# Altium schematic sheet PowerAmplifier_Control.SchDoc
size A4
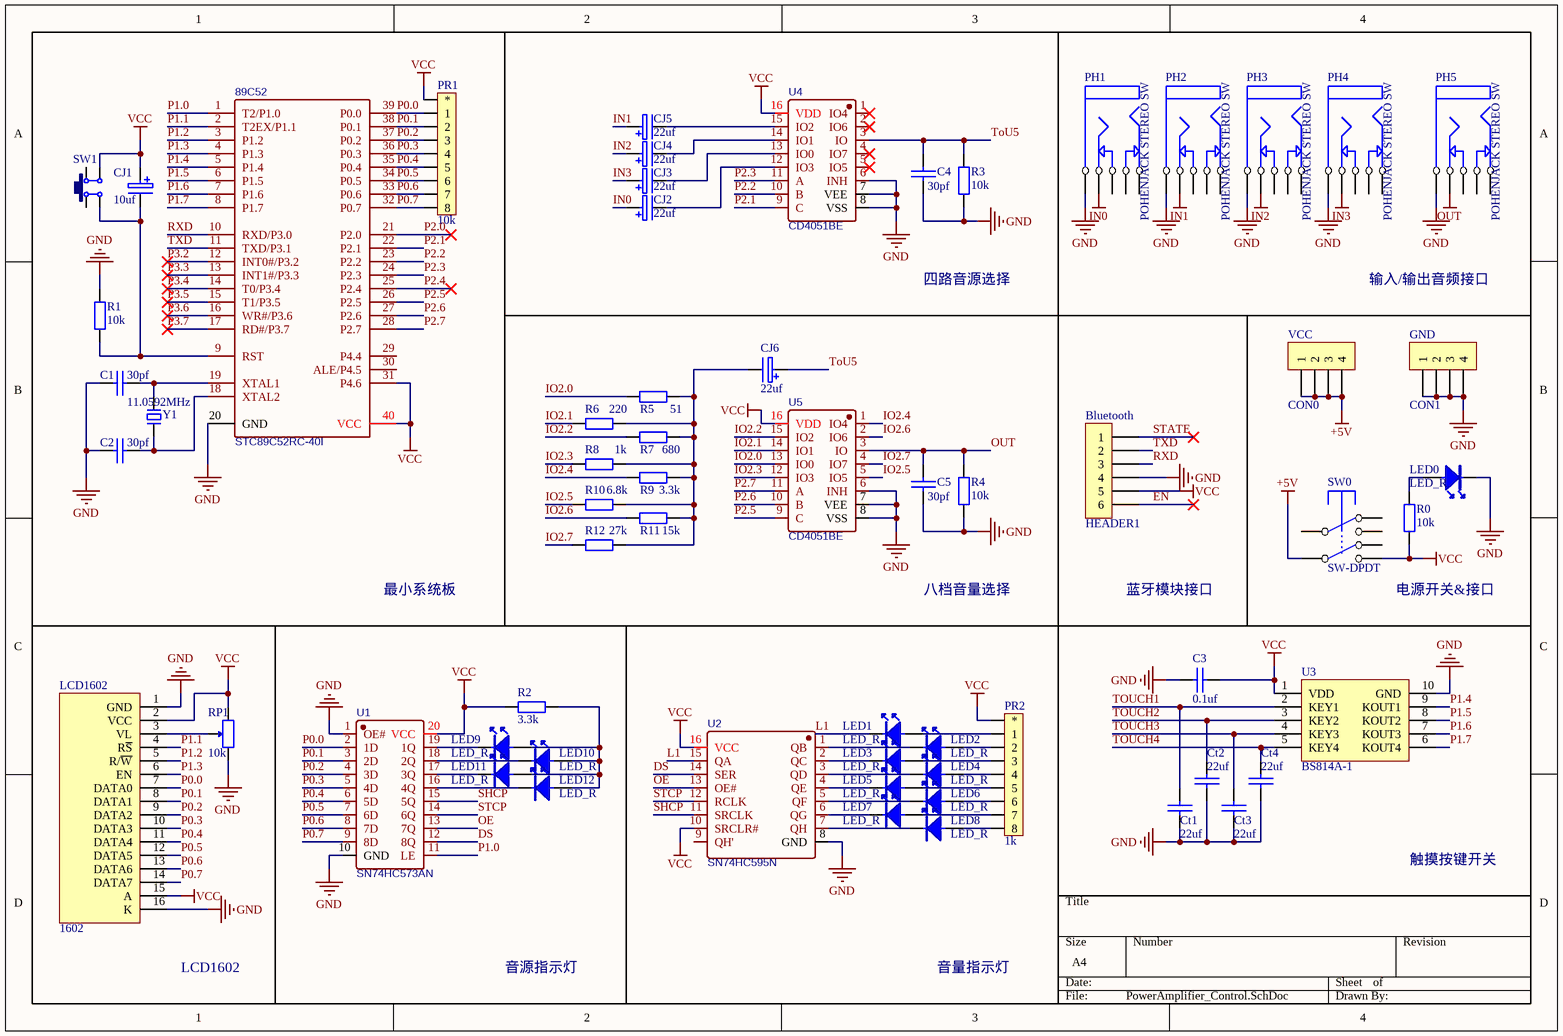
[diagram p0: PowerAmplifier_Control.SchDoc]

## Parts
89C52  STC89C52RC-40I  [DIP-40_LS15.24-L52.58-W13.97-PITCH2.54]
Bluetooth  HEADER1  [sip-6]
C1  30pf  [1206]
C2  30pf  [1206]
C3  0.1uf  [1206]
C4  30pf  [1206]
C5  30pf  [1206]
CJ1  10uf  [CAO1]
CJ2  22uf  [CAO1]
CJ3  22uf  [CAO1]
CJ4  22uf  [CAO1]
CJ5  22uf  [CAO1]
CJ6  22uf  [CAO1]
Ct1  22uf  [1206]
Ct2  22uf  [1206]
Ct3  22uf  [1206]
Ct4  22uf  [1206]
GND  CON1  [sip-4]
LCD1602  1602  [1602]
LED0  LED_R  [LED_1206]
LED1  LED_R  [LED_1206]
LED2  LED_R  [LED_1206]
LED3  LED_R  [LED_1206]
LED4  LED_R  [LED_1206]
LED5  LED_R  [LED_1206]
LED6  LED_R  [LED_1206]
LED7  LED_R  [LED_1206]
LED8  LED_R  [LED_1206]
LED9  LED_R  [LED_1206]
LED10  LED_R  [LED_1206]
LED11  LED_R  [LED_1206]
LED12  LED_R  [LED_1206]
PH1  POHENJACK STEREO SW  [POHENJACK STEREO SW]
PH2  POHENJACK STEREO SW  [POHENJACK STEREO SW]
PH3  POHENJACK STEREO SW  [POHENJACK STEREO SW]
PH4  POHENJACK STEREO SW  [POHENJACK STEREO SW]
PH5  POHENJACK STEREO SW  [POHENJACK STEREO SW]
PR1  10k  [RP1]
PR2  1k  [RP1]
R0  10k  [AXIAL0.4]
R1  10k  [AXIAL0.4]
R2  3.3k  [AXIAL0.4]
R3  10k  [AXIAL0.4]
R4  10k  [AXIAL0.4]
R5  51  [AXIAL0.4]
R6  220  [AXIAL0.4]
R7  680  [AXIAL0.4]
R8  1k  [AXIAL0.4]
R9  3.3k  [AXIAL0.4]
R10  6.8k  [AXIAL0.4]
R11  15k  [AXIAL0.4]
R12  27k  [AXIAL0.4]
RP1  10k  [3296W]
SW0  SW-DPDT  [SWH7*7]
SW1  6x6x5  [TSW DIP-6*6*6]  (value not drawn)
U1  SN74HC573AN  [DIP-20_L26.8-W6.4-P2.54-LS7.6-BL]
U2  SN74HC595N  [DIP-16_L19.8-W6.5-P2.54-LS7.6-BL]
U3  BS814A-1  [MSOP10_N]
U4  CD4051BE  [DIP-16_L20.0-W6.4-P2.54-LS7.6-BL]
U5  CD4051BE  [DIP-16_L20.0-W6.4-P2.54-LS7.6-BL]
VCC  CON0  [sip-4]
Y1  11.0592MHz  [OSC HC-49S]

## Nets
+5V: SW0.5 VCC.1 VCC.2 VCC.3 VCC.4
GND: 89C52.20(GND) Bluetooth.4 C1.2 C2.2 C3.1 C4.2 C5.2 Ct1.2 Ct2.2 Ct3.2 Ct4.2 GND.1 GND.2 GND.3 GND.4 LCD1602.1(GND) LCD1602.16(K) LED0.2 PH1.5(E) PH2.5(E) PH3.5(E) PH4.5(E) PH5.5(E) R1.1 R3.1 R4.1 RP1.1 U1.1(OE#) U1.10(GND) U2.8(GND) U3.10(GND) U4.6(INH) U4.7(VEE) U4.8(VSS) U5.6(INH) U5.7(VEE) U5.8(VSS)
IN0: CJ2.1 PH1.4(D)
IN1: CJ5.1 PH2.4(D)
IN2: CJ4.1 PH3.4(D)
IN3: CJ3.1 PH4.4(D)
OUT: C5.1 PH5.4(D) R4.2 U5.3(IO)
VCC: 89C52.31(P4.6) 89C52.40(VCC) Bluetooth.5 C3.2 CJ1.1 LCD1602.2(VCC) LCD1602.15(A) PR1.1 PR2.1 R0.2 R2.2 RP1.3 SW0.4 SW1.3 U1.20(VCC) U2.10(SRCLR#) U2.16(VCC) U3.1(VDD) U4.16(VDD) U5.16(VDD)
DS: U1.12(8Q) U2.14(SER)
EN: Bluetooth.6
IO2.0: R5.1 U5.13(IO0)
IO2.1: R6.1 U5.14(IO1)
IO2.2: R7.1 U5.15(IO2)
IO2.3: R8.1 U5.12(IO3)
IO2.4: R9.1 U5.1(IO4)
IO2.5: R10.1 U5.5(IO5)
IO2.6: R11.1 U5.2(IO6)
IO2.7: R12.1 U5.4(IO7)
L1: LED1.2 U2.15(QA)
OE: U1.13(7Q) U2.13(OE#)
P0.0: 89C52.39(P0.0) LCD1602.7(DATA0) PR1.2(1) U1.2(1D)
P0.1: 89C52.38(P0.1) LCD1602.8(DATA1) PR1.3(2) U1.3(2D)
P0.2: 89C52.37(P0.2) LCD1602.9(DATA2) PR1.4(3) U1.4(3D)
P0.3: 89C52.36(P0.3) LCD1602.10(DATA3) PR1.5(4) U1.5(4D)
P0.4: 89C52.35(P0.4) LCD1602.11(DATA4) PR1.6(5) U1.6(5D)
P0.5: 89C52.34(P0.5) LCD1602.12(DATA5) PR1.7(6) U1.7(6D)
P0.6: 89C52.33(P0.6) LCD1602.13(DATA6) PR1.8(7) U1.8(7D)
P0.7: 89C52.32(P0.7) LCD1602.14(DATA7) PR1.9(8) U1.9(8D)
P1.0: 89C52.1(T2/P1.0) U1.11(LE)
P1.1: 89C52.2(T2EX/P1.1) LCD1602.4(R~{S})
P1.2: 89C52.3(P1.2) LCD1602.5(R/~{W})
P1.3: 89C52.4(P1.3) LCD1602.6(EN)
P1.4: 89C52.5(P1.4) U3.9(KOUT1)
P1.5: 89C52.6(P1.5) U3.8(KOUT2)
P1.6: 89C52.7(P1.6) U3.7(KOUT3)
P1.7: 89C52.8(P1.7) U3.6(KOUT4)
P2.0: 89C52.21(P2.0)
P2.1: 89C52.22(P2.1) U4.9(C)
P2.2: 89C52.23(P2.2) U4.10(B)
P2.3: 89C52.24(P2.3) U4.11(A)
P2.4: 89C52.25(P2.4)
P2.5: 89C52.26(P2.5) U5.9(C)
P2.6: 89C52.27(P2.6) U5.10(B)
P2.7: 89C52.28(P2.7) U5.11(A)
P3.2: 89C52.12(INT0#/P3.2)
P3.3: 89C52.13(INT1#/P3.3)
P3.4: 89C52.14(T0/P3.4)
P3.5: 89C52.15(T1/P3.5)
P3.6: 89C52.16(WR#/P3.6)
P3.7: 89C52.17(RD#/P3.7)
RXD: 89C52.10(RXD/P3.0) Bluetooth.3
SHCP: U1.15(5Q) U2.11(SRCLK)
STATE: Bluetooth.1
STCP: U1.14(6Q) U2.12(RCLK)
ToU5: C4.1 CJ6.1 R3.2 U4.3(IO)
TOUCH1: Ct1.1 U3.2(KEY1)
TOUCH2: Ct2.1 U3.3(KEY2)
TOUCH3: Ct3.1 U3.4(KEY3)
TOUCH4: Ct4.1 U3.5(KEY4)
TXD: 89C52.11(TXD/P3.1) Bluetooth.2
Net89C52_9: 89C52.9(RST) CJ1.2 R1.2 SW1.4
Net89C52_18: 89C52.18(XTAL2) C2.1 Y1.1
Net89C52_19: 89C52.19(XTAL1) C1.1 Y1.2
NetCJ2_2: CJ2.2 U4.12(IO3)
NetCJ3_2: CJ3.2 U4.13(IO0)
NetCJ4_2: CJ4.2 U4.14(IO1)
NetCJ5_2: CJ5.2 U4.15(IO2)
NetCJ6_2: CJ6.2 R5.2 R6.2 R7.2 R8.2 R9.2 R10.2 R11.2 R12.2
NetLCD1602_3: LCD1602.3(VL) RP1.2
NetLED0_1: LED0.1 R0.1
NetLED1_1: LED1.1 PR2.2(1)
NetLED2_1: LED2.1 PR2.3(2)
NetLED2_2: LED2.2 U2.1(QB)
NetLED3_1: LED3.1 PR2.4(3)
NetLED3_2: LED3.2 U2.2(QC)
NetLED4_1: LED4.1 PR2.5(4)
NetLED4_2: LED4.2 U2.3(QD)
NetLED5_1: LED5.1 PR2.6(5)
NetLED5_2: LED5.2 U2.4(QE)
NetLED6_1: LED6.1 PR2.7(6)
NetLED6_2: LED6.2 U2.5(QF)
NetLED7_1: LED7.1 PR2.8(7)
NetLED7_2: LED7.2 U2.6(QG)
NetLED8_1: LED8.1 PR2.9(8)
NetLED8_2: LED8.2 U2.7(QH)
NetLED9_1: LED9.1 LED10.1 LED11.1 LED12.1 R2.1
NetLED9_2: LED9.2 U1.19(1Q)
NetLED10_2: LED10.2 U1.18(2Q)
NetLED11_2: LED11.2 U1.17(3Q)
NetLED12_2: LED12.2 U1.16(4Q)

Not connected (* = marked no-connect by the designer): 89C52 29(P4.4) 30(ALE/P4.5); PH1 1(A) 2(B) 3(C); PH2 1(A) 2(B) 3(C); PH3 1(A) 2(B) 3(C); PH4 1(A) 2(B) 3(C); PH5 1(A) 2(B) 3(C); SW0 1 2 3 6; SW1 1 2; U2 9(QH'); U4 1(IO4)* 2(IO6)* 4(IO7)* 5(IO5)*

## Notes on the sheet
- 四路音源选择
- 输入/输出音频接口
- 最小系统板
- 八档音量选择
- 蓝牙模块接口
- 电源开关&接口
- 触摸按键开关
- LCD1602
- 音源指示灯
- 音量指示灯

## Library data of the parts
89C52 = STC89C52RC-40I: BOM_Manufacturer: STC; BOM_Supplier: LCSC; BOM_Manufacturer Part: STC89C52RC-40I; image: //image.lceda.cn/szlcsc/C14022.jpg; BOM_Supplier Part: C14022; spicePre: U; spiceSymbolName: STC89C52RC-40I
Bluetooth = CON6: Connector
C1-C5 Ct1-Ct4 = CAP1
CJ1-CJ6 = CAP3
GND VCC = CON4: Connector
LED0-LED12 = LED
PR1 PR2 = PRES1
R0-R12 = R: 贴片电阻; 版权归属: 源创客; BOM名称: 贴片电阻; 学习资源: www.ooocke.com
RP1 = RP-ID: 插件单联电位器; BOM名称: 插件电位器; 版权归属: 源创客; 学习资源: www.ooocke.com
SW1 = TSW DIP-6x6: 直插6x6轻触开关; 版权归属: 源创客; BOM名称: 直插6x6轻触开关; 学习资源: www.ooocke.com
U1 = SN74HC573AN: BOM_Manufacturer: TI; spicePre: X; BOM_Supplier: LCSC; BOM_Manufacturer Part: SN74HC573AN; image: //image.lceda.cn/szlcsc/C5196.jpg; BOM_Supplier Part: C5196; spiceSymbolName: SN74HC573AN
U2 = SN74HC595N: BOM_Manufacturer: TI; BOM_Supplier: LCSC; BOM_Manufacturer Part: SN74HC595N; image: //image.lceda.cn/szlcsc/C78711.jpg; BOM_Supplier Part: C78711; spicePre: U; spiceSymbolName: SN74HC595N
U3 = BS814A: 4键电容触摸按键芯片; 版权归属: 源创客; BOM名称: 4键电容触摸按键芯片; 学习资源: www.ooocke.com
U4 U5 = CD4051BE: BOM_Manufacturer: TI; spicePre: X; BOM_Supplier: LCSC; BOM_Manufacturer Part: CD4051BE; image: //image.lceda.cn/szlcsc/C5200.jpg; BOM_Supplier Part: C5200; spiceSymbolName: CD4051BE
Y1 = XTAL-2P: 2脚无源脚晶振; 版权归属: 源创客; BOM名称: 2脚无源脚晶振; 学习资源: www.ooocke.com